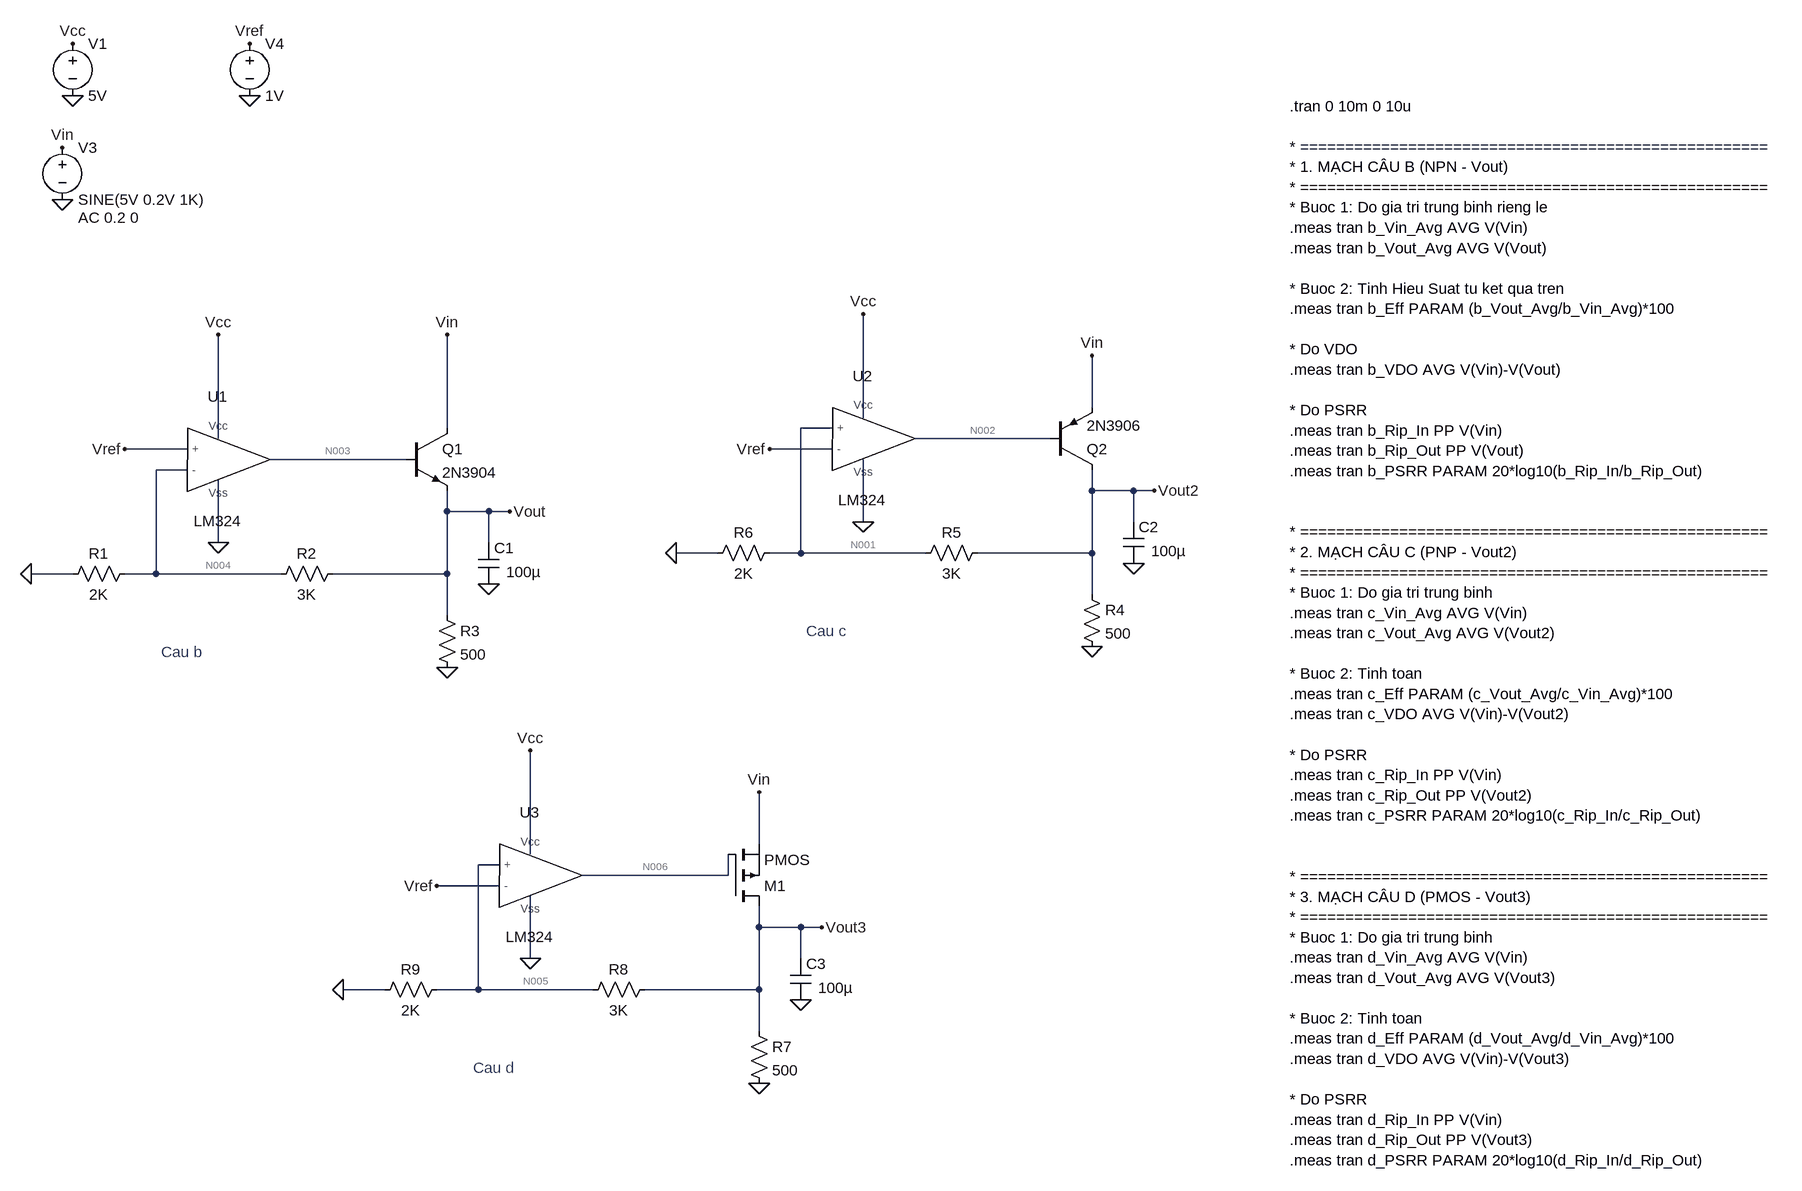
[diagram p0: schematic BAI 7 CHUAN BI 1.asc]
BAI 7 CHUAN BI 1.asc, the LTspice schematic file:
Version 4.1
SHEET 1 3088 1108
WIRE 1664 48 1664 -32
WIRE 1312 64 1312 -96
WIRE 672 80 672 -64
WIRE 1264 80 1216 80
WIRE 320 96 320 -64
WIRE 1600 96 1392 96
WIRE 272 112 176 112
WIRE 1264 112 1168 112
WIRE 608 128 400 128
WIRE 272 144 224 144
WIRE 1664 176 1664 144
WIRE 1728 176 1664 176
WIRE 1760 176 1728 176
WIRE 672 208 672 176
WIRE 736 208 672 208
WIRE 768 208 736 208
WIRE 1312 224 1312 128
WIRE 1728 224 1728 176
WIRE 320 256 320 160
WIRE 736 256 736 208
WIRE 1088 272 1024 272
WIRE 1216 272 1216 80
WIRE 1216 272 1168 272
WIRE 1408 272 1216 272
WIRE 1664 272 1664 176
WIRE 1664 272 1488 272
WIRE 96 304 32 304
WIRE 224 304 224 144
WIRE 224 304 176 304
WIRE 416 304 224 304
WIRE 672 304 672 208
WIRE 672 304 496 304
WIRE 1664 336 1664 272
WIRE 672 368 672 304
WIRE 1152 720 1152 640
WIRE 800 736 800 576
WIRE 752 752 720 752
WIRE 1104 768 1104 736
WIRE 1104 768 880 768
WIRE 752 784 656 784
WIRE 1152 848 1152 816
WIRE 1216 848 1152 848
WIRE 1248 848 1216 848
WIRE 800 896 800 800
WIRE 1216 896 1216 848
WIRE 576 944 512 944
WIRE 720 944 720 752
WIRE 720 944 656 944
WIRE 896 944 720 944
WIRE 1152 944 1152 848
WIRE 1152 944 976 944
WIRE 1152 1008 1152 944
FLAG 320 -64 Vcc
FLAG 672 -64 Vin
FLAG 736 320 0
FLAG 672 448 0
FLAG 768 208 Vout
FLAG 32 304 0
FLAG 176 112 Vref
FLAG 96 -432 0
FLAG 368 -432 0
FLAG 80 -272 0
FLAG 96 -512 Vcc
FLAG 368 -512 Vref
FLAG 80 -352 Vin
FLAG 1312 -96 Vcc
FLAG 1664 -32 Vin
FLAG 1728 288 0
FLAG 1664 416 0
FLAG 1760 176 Vout2
FLAG 1024 272 0
FLAG 1168 112 Vref
FLAG 800 576 Vcc
FLAG 1152 640 Vin
FLAG 1216 960 0
FLAG 1152 1088 0
FLAG 1248 848 Vout3
FLAG 512 944 0
FLAG 656 784 Vref
FLAG 320 256 0
FLAG 1312 224 0
FLAG 800 896 0
SYMBOL LM324 320 128 R0
SYMATTR InstName U1
SYMBOL npn 608 80 R0
SYMATTR InstName Q1
SYMATTR Value 2N3904
SYMBOL cap 720 256 R0
WINDOW 3 43 45 Left 2
SYMATTR Value 100µ
SYMATTR InstName C1
SYMBOL res 656 352 R0
SYMATTR InstName R3
SYMATTR Value 500
SYMBOL res 512 288 R90
WINDOW 0 0 56 VBottom 2
WINDOW 3 32 56 VTop 2
SYMATTR InstName R2
SYMATTR Value 3K
SYMBOL res 192 288 R90
WINDOW 0 0 56 VBottom 2
WINDOW 3 32 56 VTop 2
SYMATTR InstName R1
SYMATTR Value 2K
SYMBOL voltage 96 -528 R0
SYMATTR InstName V1
SYMATTR Value 5V
SYMBOL voltage 80 -368 R0
WINDOW 123 24 124 Left 2
WINDOW 39 0 0 Left 0
SYMATTR Value2 AC 0.2 0
SYMATTR InstName V3
SYMATTR Value SINE(5V 0.2V 1K)
SYMBOL voltage 368 -528 R0
SYMATTR InstName V4
SYMATTR Value 1V
SYMBOL cap 1712 224 R0
WINDOW 3 43 45 Left 2
SYMATTR Value 100µ
SYMATTR InstName C2
SYMBOL res 1648 320 R0
SYMATTR InstName R4
SYMATTR Value 500
SYMBOL res 1504 256 R90
WINDOW 0 0 56 VBottom 2
WINDOW 3 32 56 VTop 2
SYMATTR InstName R5
SYMATTR Value 3K
SYMBOL res 1184 256 R90
WINDOW 0 0 56 VBottom 2
WINDOW 3 32 56 VTop 2
SYMATTR InstName R6
SYMATTR Value 2K
SYMBOL pnp 1600 144 M180
SYMATTR InstName Q2
SYMATTR Value 2N3906
SYMBOL cap 1200 896 R0
WINDOW 3 43 45 Left 2
SYMATTR Value 100µ
SYMATTR InstName C3
SYMBOL res 1136 992 R0
SYMATTR InstName R7
SYMATTR Value 500
SYMBOL res 992 928 R90
WINDOW 0 0 56 VBottom 2
WINDOW 3 32 56 VTop 2
SYMATTR InstName R8
SYMATTR Value 3K
SYMBOL res 672 928 R90
WINDOW 0 0 56 VBottom 2
WINDOW 3 32 56 VTop 2
SYMATTR InstName R9
SYMATTR Value 2K
SYMBOL pmos 1104 816 M180
SYMATTR InstName M1
SYMBOL LM324 1312 96 R0
SYMATTR InstName U2
SYMBOL LM324 800 768 R0
SYMATTR InstName U3
TEXT 232 424 Left 2 ;Cau b
TEXT 1224 392 Left 2 ;Cau c
TEXT 712 1064 Left 2 ;Cau d
TEXT 1968 -416 Left 2 !.tran 0 10m 0 10u\n \n* ====================================================\n* 1. MẠCH CÂU B (NPN - Vout)\n* ====================================================\n* Buoc 1: Do gia tri trung binh rieng le\n.meas tran b_Vin_Avg AVG V(Vin)\n.meas tran b_Vout_Avg AVG V(Vout)\n \n* Buoc 2: Tinh Hieu Suat tu ket qua tren\n.meas tran b_Eff PARAM (b_Vout_Avg/b_Vin_Avg)*100\n \n* Do VDO\n.meas tran b_VDO AVG V(Vin)-V(Vout)\n \n* Do PSRR\n.meas tran b_Rip_In PP V(Vin)\n.meas tran b_Rip_Out PP V(Vout)\n.meas tran b_PSRR PARAM 20*log10(b_Rip_In/b_Rip_Out)\n \n\n* ====================================================\n* 2. MẠCH CÂU C (PNP - Vout2)\n* ====================================================\n* Buoc 1: Do gia tri trung binh\n.meas tran c_Vin_Avg AVG V(Vin)\n.meas tran c_Vout_Avg AVG V(Vout2)\n \n* Buoc 2: Tinh toan\n.meas tran c_Eff PARAM (c_Vout_Avg/c_Vin_Avg)*100\n.meas tran c_VDO AVG V(Vin)-V(Vout2)\n \n* Do PSRR\n.meas tran c_Rip_In PP V(Vin)\n.meas tran c_Rip_Out PP V(Vout2)\n.meas tran c_PSRR PARAM 20*log10(c_Rip_In/c_Rip_Out)\n \n\n* ====================================================\n* 3. MẠCH CÂU D (PMOS - Vout3)\n* ====================================================\n* Buoc 1: Do gia tri trung binh\n.meas tran d_Vin_Avg AVG V(Vin)\n.meas tran d_Vout_Avg AVG V(Vout3)\n \n* Buoc 2: Tinh toan\n.meas tran d_Eff PARAM (d_Vout_Avg/d_Vin_Avg)*100\n.meas tran d_VDO AVG V(Vin)-V(Vout3)\n \n* Do PSRR\n.meas tran d_Rip_In PP V(Vin)\n.meas tran d_Rip_Out PP V(Vout3)\n.meas tran d_PSRR PARAM 20*log10(d_Rip_In/d_Rip_Out)

The netlist it stands for:
* BAI 7 CHUAN BI 1.asc
X§U1 Vref N004 Vcc 0 N003 LM324  ; pins + - Vcc Vss ?
Q1 Vin N003 Vout 0 2N3904
C1 Vout 0 100µ
R3 Vout 0 500
R2 Vout N004 3K
R1 N004 0 2K
V1 Vcc 0 5V
V3 Vin 0 SINE(5V 0.2V 1K) AC 0.2 0
V4 Vref 0 1V
C2 Vout2 0 100µ
R4 Vout2 0 500
R5 Vout2 N001 3K
R6 N001 0 2K
Q2 Vout2 N002 Vin 0 2N3906
C3 Vout3 0 100µ
R7 Vout3 0 500
R8 Vout3 N005 3K
R9 N005 0 2K
M1 Vout3 N006 Vin Vin PMOS
X§U2 N001 Vref Vcc 0 N002 LM324  ; pins + - Vcc Vss ?
X§U3 N005 Vref Vcc 0 N006 LM324  ; pins + - Vcc Vss ?
.model NPN NPN
.model PNP PNP
.lib standard.bjt
.model NMOS NMOS
.model PMOS PMOS
.lib standard.mos
* Cau b
* Cau c
* Cau d
.tran 0 10m 0 10u
* ====================================================
* 1. MẠCH CÂU B (NPN - Vout)
* ====================================================
* Buoc 1: Do gia tri trung binh rieng le
.meas tran b_Vin_Avg AVG V(Vin)
.meas tran b_Vout_Avg AVG V(Vout)
* Buoc 2: Tinh Hieu Suat tu ket qua tren
.meas tran b_Eff PARAM (b_Vout_Avg/b_Vin_Avg)*100
* Do VDO
.meas tran b_VDO AVG V(Vin)-V(Vout)
* Do PSRR
.meas tran b_Rip_In PP V(Vin)
.meas tran b_Rip_Out PP V(Vout)
.meas tran b_PSRR PARAM 20*log10(b_Rip_In/b_Rip_Out)
* ====================================================
* 2. MẠCH CÂU C (PNP - Vout2)
* ====================================================
* Buoc 1: Do gia tri trung binh
.meas tran c_Vin_Avg AVG V(Vin)
.meas tran c_Vout_Avg AVG V(Vout2)
* Buoc 2: Tinh toan
.meas tran c_Eff PARAM (c_Vout_Avg/c_Vin_Avg)*100
.meas tran c_VDO AVG V(Vin)-V(Vout2)
* Do PSRR
.meas tran c_Rip_In PP V(Vin)
.meas tran c_Rip_Out PP V(Vout2)
.meas tran c_PSRR PARAM 20*log10(c_Rip_In/c_Rip_Out)
* ====================================================
* 3. MẠCH CÂU D (PMOS - Vout3)
* ====================================================
* Buoc 1: Do gia tri trung binh
.meas tran d_Vin_Avg AVG V(Vin)
.meas tran d_Vout_Avg AVG V(Vout3)
* Buoc 2: Tinh toan
.meas tran d_Eff PARAM (d_Vout_Avg/d_Vin_Avg)*100
.meas tran d_VDO AVG V(Vin)-V(Vout3)
* Do PSRR
.meas tran d_Rip_In PP V(Vin)
.meas tran d_Rip_Out PP V(Vout3)
.meas tran d_PSRR PARAM 20*log10(d_Rip_In/d_Rip_Out)
.lib E:\ThiThucHanhCoHa\CoHa\LM324.cir
.backanno
.end

* Results of the author's LTspice run, read from the files saved beside the schematic
* Operating Point, zero values left out:
*   V(n001) = 1.994 V
*   V(n002) = 3.496 V
*   V(n003) = 3.2 V
*   V(n004) = 1 V
*   V(n005) = 45.4 mV
*   V(n006) = 4.385 mV
*   V(vcc) = 5 V
*   V(vin) = 5 V
*   V(vout) = 2.5 V
*   V(vout2) = 4.985 V
*   V(vout3) = 113.4 mV
*   V(vref) = 1 V
*   I(R1) = 500 µA
*   I(R2) = 500 µA
*   I(R3) = 5 mA
*   I(R4) = 9.969 mA
*   I(R5) = 996.9 µA
*   I(R6) = 996.9 µA
*   I(R7) = 226.8 µA
*   I(R8) = 22.66 µA
*   I(R9) = 22.7 µA
*   I(V1) = -517 µA
*   I(V3) = -52.08 mA
*   I(V4) = 60.27 nA
*   Ib(M1) = 4.897 pA
*   Ib(Q1) = 18.19 µA
*   Ib(Q2) = -35.38 mA
*   Ic(Q1) = 5.482 mA
*   Ic(Q2) = -10.97 mA
*   Id(M1) = -249.4 µA
*   Ie(Q1) = -5.5 mA
*   Ie(Q2) = 46.35 mA
*   Is(M1) = 249.4 µA
*   Ix(u1:1) = -20.1 nA
*   Ix(u1:2) = -20.08 nA
*   Ix(u1:3) = 175 µA
*   Ix(u1:4) = -175 µA
*   Ix(u1:5) = -18.19 µA
*   Ix(u2:1) = 2.359 pA
*   Ix(u2:2) = -40.17 nA
*   Ix(u2:3) = 167 µA
*   Ix(u2:4) = -175 µA
*   Ix(u2:5) = 35.38 mA
*   Ix(u3:1) = -40.37 nA
*   Ix(u3:2) = 1.326 pA
*   Ix(u3:3) = 175 µA
*   Ix(u3:4) = -167 µA
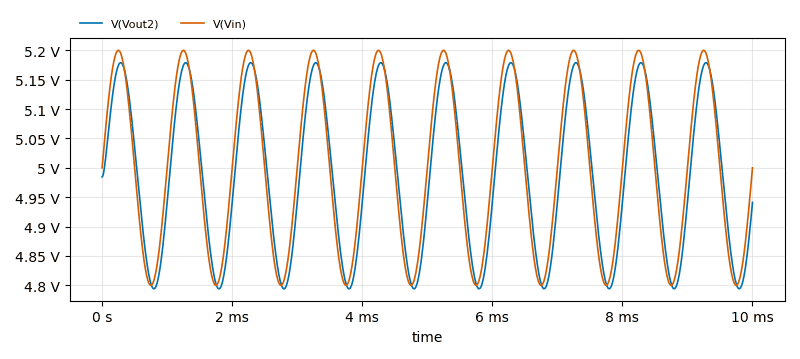
[diagram p1: Transient Analysis of BAI 7 CHUAN BI 1.asc, plotted from the saved traces]
* Transient Analysis, 1 run:
*   V(Vout2): min 4.794 V, max 5.179 V, average 4.988 V, rms 4.99 V, last 4.941 V
*   V(Vin): min 4.8 V, max 5.2 V, average 5 V, rms 5.002 V, last 5 V
* From the log:
*   b_vin_avg: AVG(V(Vin))=5.00000745297 FROM 0 TO 0.01
*   b_vout_avg: AVG(V(Vout))=2.5000465105 FROM 0 TO 0.01
*   b_eff: (b_Vout_Avg/b_Vin_Avg)*100=50.0008556791
*   b_vdo: AVG(V(Vin)-V(Vout))=2.49996094247 FROM 0 TO 0.01
*   b_rip_in: PP(V(Vin))=0.399923324585 FROM 0 TO 0.01
*   b_rip_out: PP(V(Vout))=4.76837158203e-07 FROM 0 TO 0.01
*   b_psrr: 20*log10(b_Rip_In/b_Rip_Out)=118.47213286
*   c_vin_avg: AVG(V(Vin))=5.00000745297 FROM 0 TO 0.01
*   c_vout_avg: AVG(V(Vout2))=4.98846231181 FROM 0 TO 0.01
*   c_eff: (c_Vout_Avg/c_Vin_Avg)*100=99.7690975209
*   c_vdo: AVG(V(Vin)-V(Vout2))=0.011545141165 FROM 0 TO 0.01
*   c_rip_in: PP(V(Vin))=0.399923324585 FROM 0 TO 0.01
*   c_rip_out: PP(V(Vout2))=0.384967327118 FROM 0 TO 0.01
*   c_psrr: 20*log10(c_Rip_In/c_Rip_Out)=0.331057247387
*   d_vin_avg: AVG(V(Vin))=5.00000745297 FROM 0 TO 0.01
*   d_vout_avg: AVG(V(Vout3))=0.113428331857 FROM 0 TO 0.01
*   d_eff: (d_Vout_Avg/d_Vin_Avg)*100=2.26856325563
*   d_vdo: AVG(V(Vin)-V(Vout3))=4.88657912111 FROM 0 TO 0.01
*   d_rip_in: PP(V(Vin))=0.399923324585 FROM 0 TO 0.01
*   d_rip_out: PP(V(Vout3))=7.4714422226e-05 FROM 0 TO 0.01
*   d_psrr: 20*log10(d_Rip_In/d_Rip_Out)=74.5714458343